# Altium schematic sheet SCH_A4_TempClassic.SchDoc
size A4
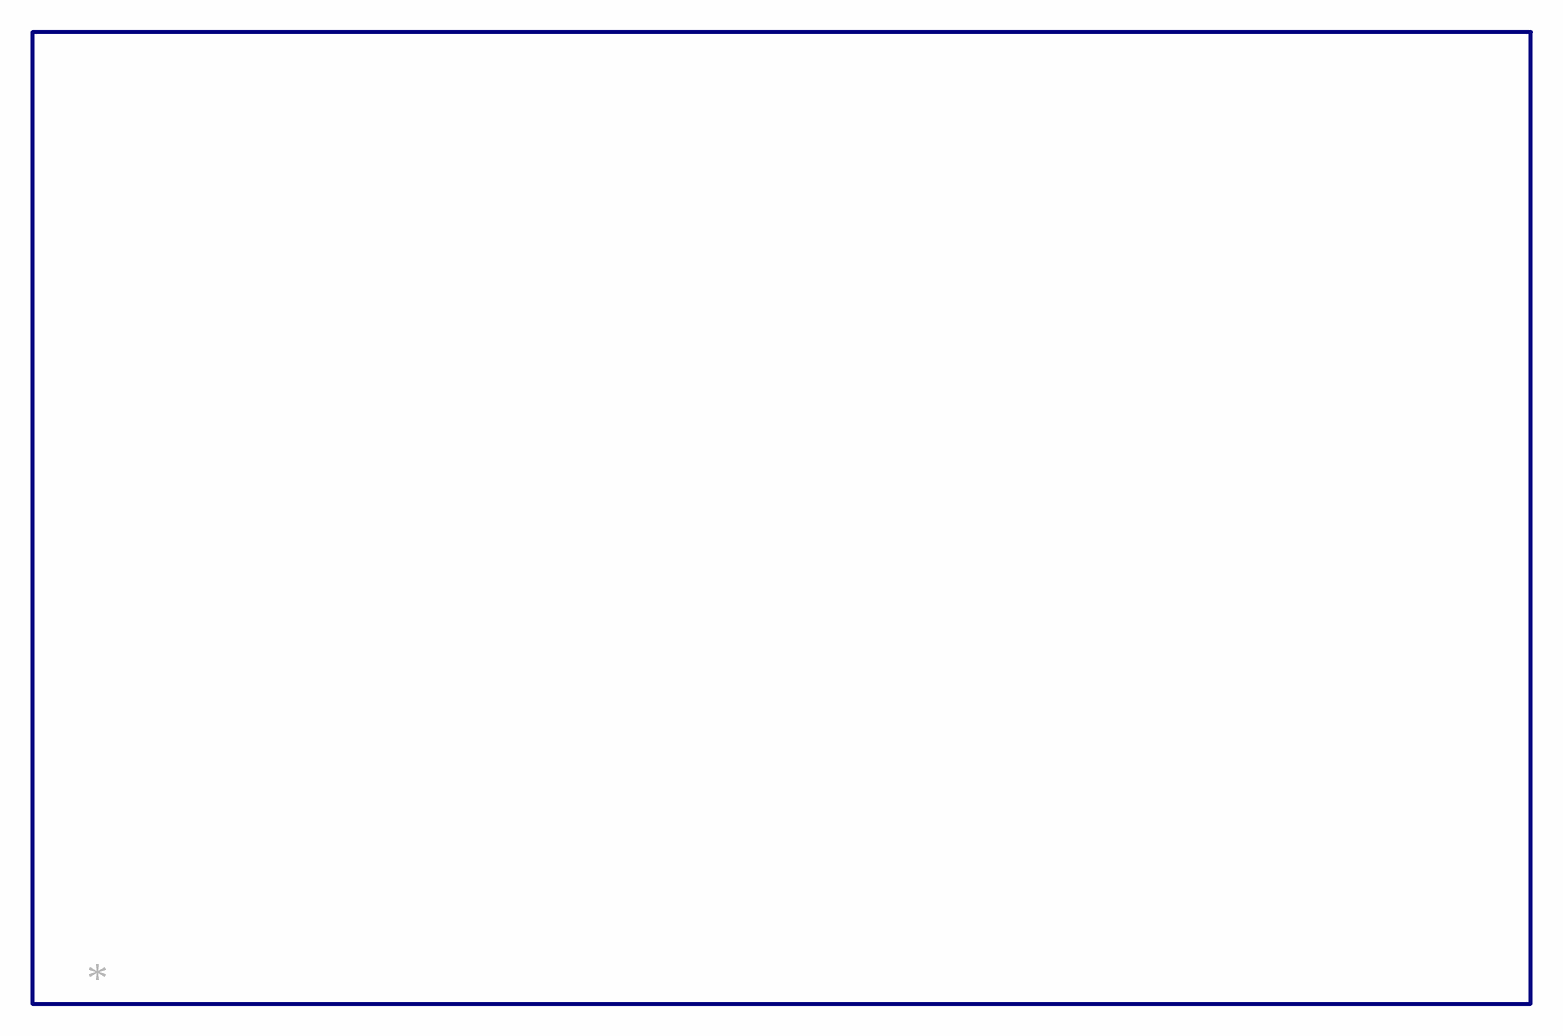
[diagram p0: SCH_A4_TempClassic.SchDoc]